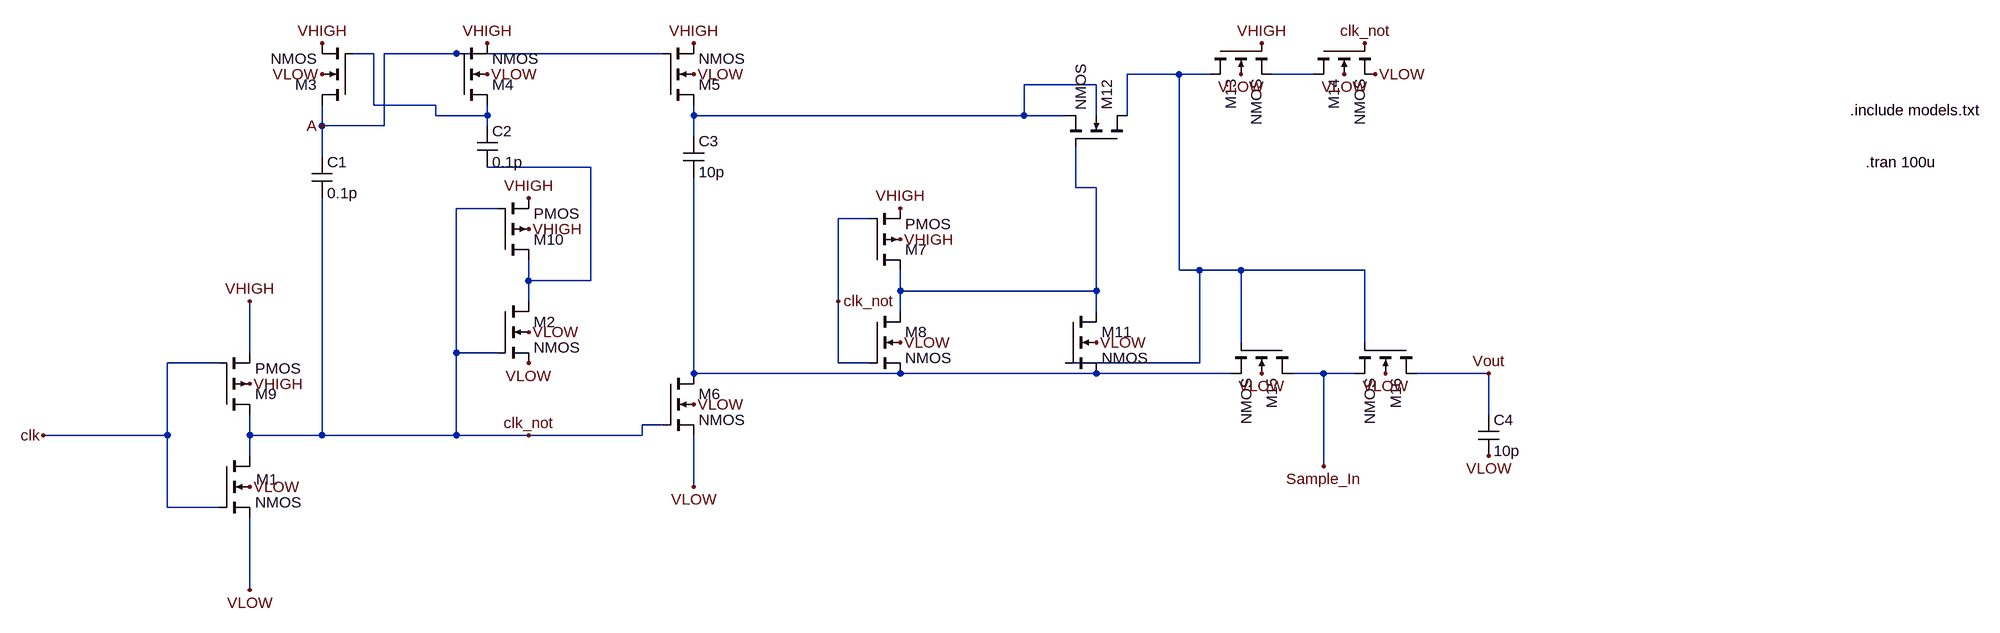
[diagram p0: schematic sample_hold.asc]
sample_hold.asc, the LTspice schematic file:
Version 4
SHEET 1 2688 772
WIRE 176 -176 144 -176
WIRE 304 -176 192 -176
WIRE 624 -176 304 -176
WIRE 1424 -144 1344 -144
WIRE 1472 -144 1424 -144
WIRE 1632 -144 1568 -144
WIRE 1296 -128 1184 -128
WIRE 176 -96 176 -176
WIRE 272 -96 176 -96
WIRE 272 -80 272 -96
WIRE 352 -80 352 -96
WIRE 352 -80 272 -80
WIRE 672 -80 672 -96
WIRE 1184 -80 1184 -128
WIRE 1184 -80 672 -80
WIRE 1248 -80 1184 -80
WIRE 1296 -80 1296 -128
WIRE 1344 -80 1344 -144
WIRE 96 -64 96 -96
WIRE 192 -64 192 -176
WIRE 192 -64 96 -64
WIRE 352 -64 352 -80
WIRE 672 -48 672 -80
WIRE 96 -16 96 -64
WIRE 512 0 352 0
WIRE 1264 32 1264 -32
WIRE 1296 32 1264 32
WIRE 368 64 304 64
WIRE 944 80 896 80
WIRE 1424 160 1424 -144
WIRE 1456 160 1424 160
WIRE 1520 160 1456 160
WIRE 1712 160 1520 160
WIRE 416 176 416 144
WIRE 512 176 512 0
WIRE 512 176 416 176
WIRE 992 192 992 160
WIRE 1296 192 1296 32
WIRE 1296 192 992 192
WIRE 416 208 416 176
WIRE 896 208 896 80
WIRE 992 224 992 192
WIRE 1296 224 1296 192
WIRE 1520 272 1520 160
WIRE 1712 272 1712 160
WIRE -16 288 -16 208
WIRE 304 288 304 64
WIRE 368 288 304 288
WIRE -64 304 -144 304
WIRE 896 304 896 208
WIRE 944 304 896 304
WIRE 1456 304 1456 160
WIRE 1456 304 1248 304
WIRE 672 320 672 16
WIRE 992 320 672 320
WIRE 1296 320 992 320
WIRE 1504 320 1296 320
WIRE 1648 320 1600 320
WIRE 1696 320 1648 320
WIRE 1904 320 1792 320
WIRE 1904 384 1904 320
WIRE 624 400 592 400
WIRE -144 416 -144 304
WIRE -144 416 -336 416
WIRE -16 416 -16 384
WIRE 96 416 96 48
WIRE 96 416 -16 416
WIRE 304 416 304 288
WIRE 304 416 96 416
WIRE 416 416 304 416
WIRE 592 416 592 400
WIRE 592 416 416 416
WIRE -16 448 -16 416
WIRE 1648 464 1648 320
WIRE 672 496 672 416
WIRE -144 528 -144 416
WIRE -64 528 -144 528
WIRE -16 656 -16 544
FLAG -336 416 clk
FLAG -16 208 VHIGH
FLAG -16 656 VLOW
FLAG 416 48 VHIGH
FLAG 416 304 VLOW
FLAG 352 -192 VHIGH
FLAG 96 -192 VHIGH
FLAG 672 -192 VHIGH
FLAG 416 96 VHIGH
FLAG 96 -144 VLOW
FLAG 352 -144 VLOW
FLAG 416 256 VLOW
FLAG -16 496 VLOW
FLAG -16 336 VHIGH
FLAG 672 -144 VLOW
FLAG 896 208 clk_not
FLAG 992 64 VHIGH
FLAG 992 112 VHIGH
FLAG 992 272 VLOW
FLAG 1296 272 VLOW
FLAG 1552 -192 VHIGH
FLAG 1520 -144 VLOW
FLAG 1680 -144 VLOW
FLAG 1728 -144 VLOW
FLAG 1552 320 VLOW
FLAG 1744 320 VLOW
FLAG 1712 -192 clk_not
FLAG 1904 320 Vout
FLAG 1904 448 VLOW
FLAG 1648 464 Sample_In
FLAG 96 -64 A
FLAG 672 496 VLOW
FLAG 672 368 VLOW
FLAG 416 416 clk_not
SYMBOL nmos4 -64 448 R0
WINDOW 0 58 36 Left 2
SYMATTR InstName M1
SYMATTR Value2 l=50n w=2.5u
SYMBOL nmos4 368 208 R0
SYMATTR InstName M2
SYMATTR Value2 l=50n w=2.5u
SYMBOL nmos4 144 -96 R180
SYMATTR InstName M3
SYMATTR Value2 l=50n w=1u
SYMBOL nmos4 304 -96 M180
SYMATTR InstName M4
SYMATTR Value2 l=50n w=5u
SYMBOL nmos4 624 -96 M180
SYMATTR InstName M5
SYMATTR Value2 l=50n w=5u
SYMBOL pmos4 -64 384 M180
SYMATTR InstName M9
SYMATTR Value2 l=50n w=5u
SYMBOL pmos4 368 144 M180
SYMATTR InstName M10
SYMATTR Value2 l=50n w=5u
SYMBOL cap 80 -16 R0
SYMATTR InstName C1
SYMATTR Value 0.1p
SYMBOL cap 336 -64 R0
SYMATTR InstName C2
SYMATTR Value 0.1p
SYMBOL cap 656 -48 R0
SYMATTR InstName C3
SYMATTR Value 10p
SYMBOL pmos4 944 160 M180
SYMATTR InstName M7
SYMATTR Value2 l=50n w=5u
SYMBOL nmos4 944 224 R0
SYMATTR InstName M8
SYMATTR Value2 l=50n w=2.5u
SYMBOL nmos4 1248 224 R0
SYMATTR InstName M11
SYMATTR Value2 l=50n w=2.5u
SYMBOL nmos4 1344 -32 M270
SYMATTR InstName M12
SYMATTR Value2 l=50n w=1u
SYMBOL nmos4 1472 -192 M90
SYMATTR InstName M13
SYMATTR Value2 l=50n w=5u
SYMBOL nmos4 1632 -192 M90
SYMATTR InstName M14
SYMATTR Value2 l=50n w=5u
SYMBOL nmos4 1600 272 R90
SYMATTR InstName M15
SYMATTR Value2 l=50n w=5u
SYMBOL nmos4 1792 272 R90
SYMATTR InstName M16
SYMATTR Value2 l=50n w=5u
SYMBOL cap 1888 384 R0
SYMATTR InstName C4
SYMATTR Value 10p
SYMBOL nmos4 624 320 R0
SYMATTR InstName M6
SYMATTR Value2 l=50n w=2.5u
TEXT 2464 -88 Left 2 !.include models.txt
TEXT 2488 -8 Left 2 !.tran 100u

The netlist it stands for:
* sample_hold.asc
M1 clk_not clk VLOW VLOW NMOS l=50n w=2.5u
M2 N005 clk_not VLOW VLOW NMOS l=50n w=2.5u
M3 A N001 VHIGH VLOW NMOS l=50n w=1u
M4 N001 A VHIGH VLOW NMOS l=50n w=5u
M5 N004 A VHIGH VLOW NMOS l=50n w=5u
M9 clk_not clk VHIGH VHIGH PMOS l=50n w=5u
M10 N005 clk_not VHIGH VHIGH PMOS l=50n w=5u
C1 A clk_not 0.1p
C2 N001 N005 0.1p
C3 N004 N007 10p
M7 N006 clk_not VHIGH VHIGH PMOS l=50n w=5u
M8 N006 clk_not N007 VLOW NMOS l=50n w=2.5u
M11 N006 N002 N007 VLOW NMOS l=50n w=2.5u
M12 N002 N006 N004 N004 NMOS l=50n w=1u
M13 N002 VHIGH N003 VLOW NMOS l=50n w=5u
M14 N003 clk_not VLOW VLOW NMOS l=50n w=5u
M15 Sample_In N002 N007 VLOW NMOS l=50n w=5u
M16 Vout N002 Sample_In VLOW NMOS l=50n w=5u
C4 Vout VLOW 10p
M6 N007 clk_not VLOW VLOW NMOS l=50n w=2.5u
.model NMOS NMOS
.model PMOS PMOS
.lib standard.mos
.include models.txt
.tran 100u
.backanno
.end